# EAGLE design UT61EWIFI (EAGLE 9.6.2)
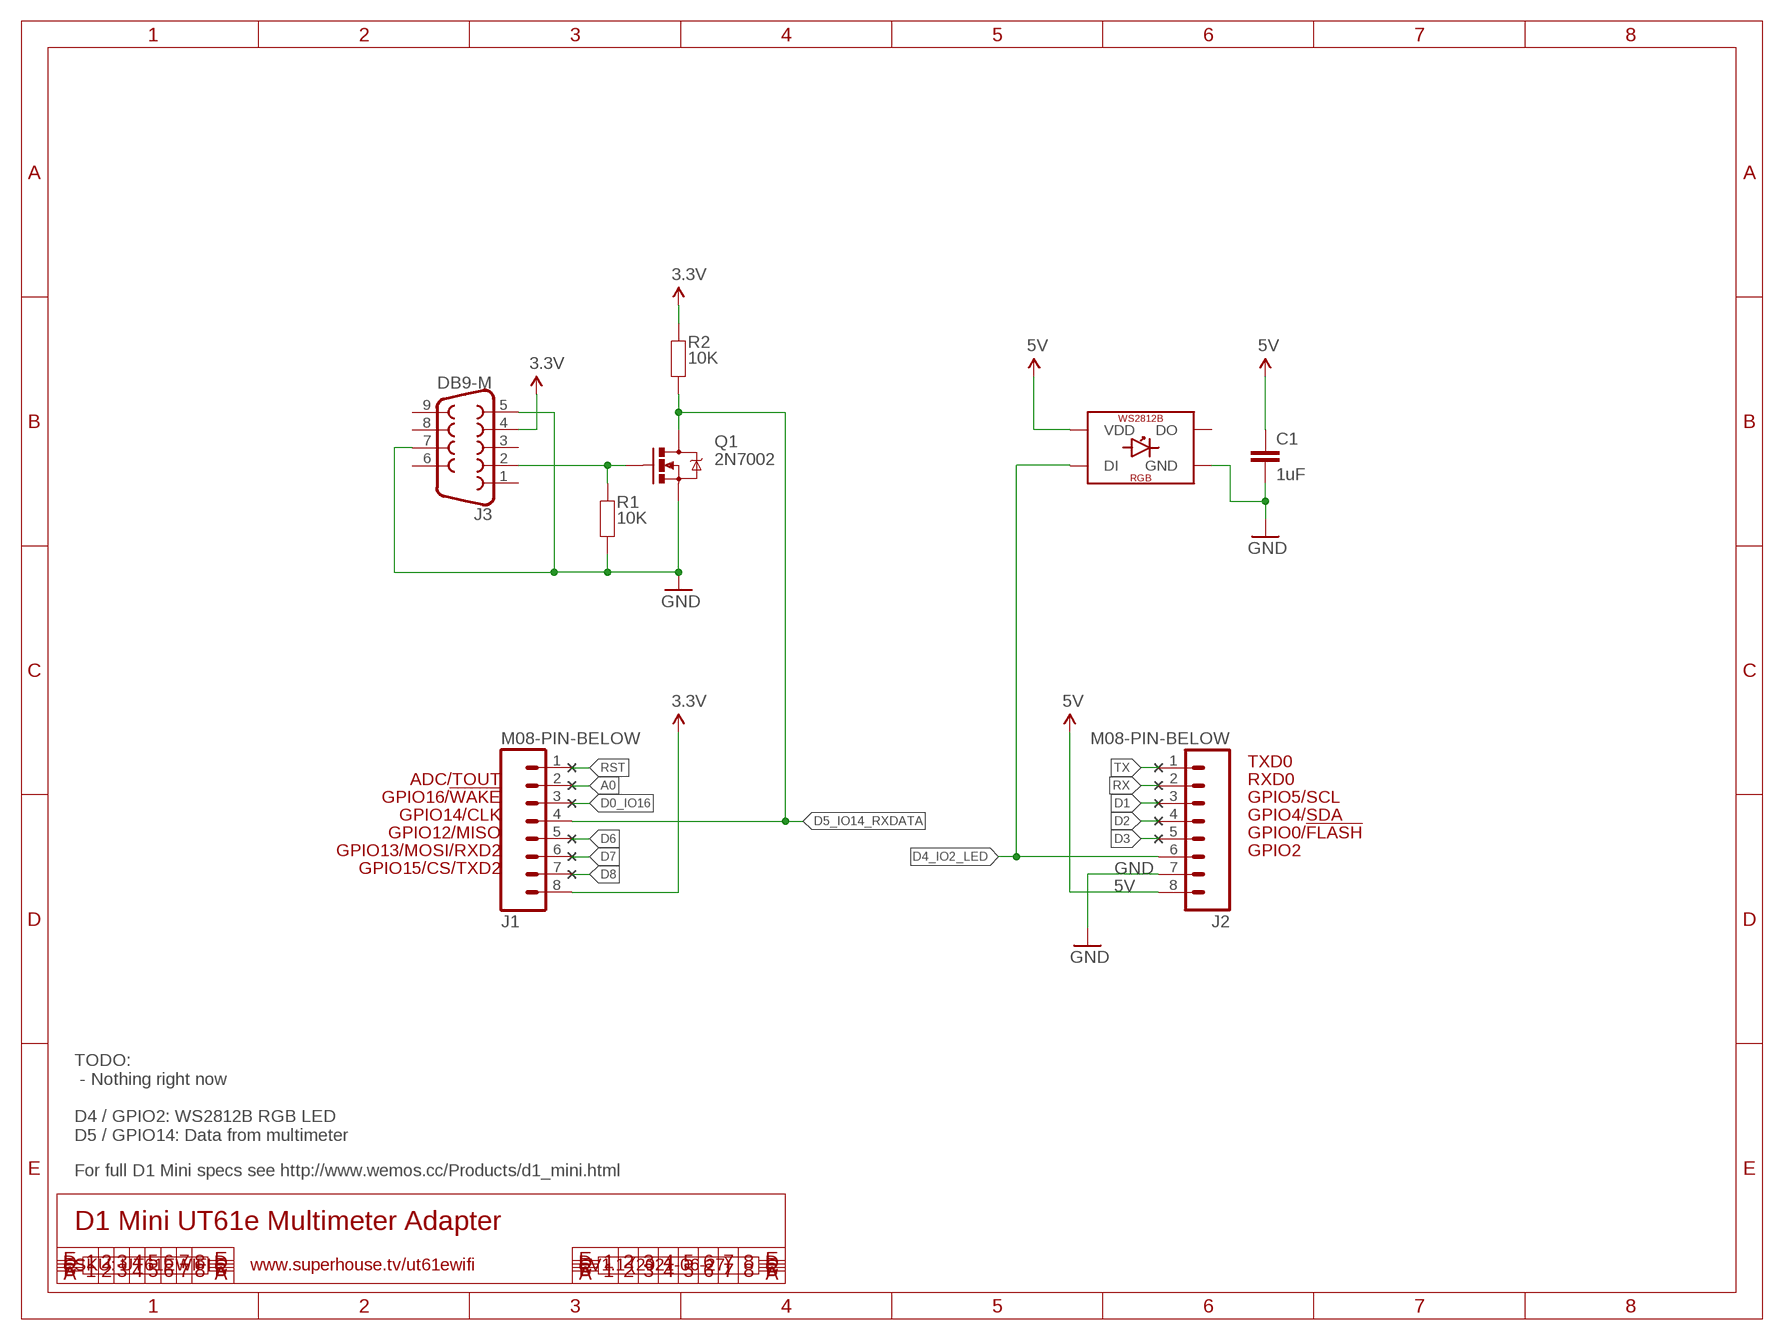
[diagram p0: schematic, sheet 1]

## Parts
C1  1uF  CAP0603  [C0603]
J1  M08-PIN-BELOW  [1X08-P-BELOW]
J2  M08-PIN-BELOW  [1X08-P-BELOW]
J3  DB9-M  DB9-PCB-PLUG  [DB9-PCB-PLUG]
LED1  WS2812B  WS2812B5050  [WS2812B]
Q1  2N7002  MOSFET-NCHANNEL-233  [SOT23-3]
R1  10K  RESISTOR0603  [R0603]
R2  10K  RESISTOR0603  [R0603]

## Nets
3.3V: J1.8 J3.4 R2.2
5V: C1.1 J2.8 LED1.1-VDD(VDD)
A0: J1.2
D0_IO16: J1.3
D1: J2.3
D2: J2.4
D3: J2.5
D4_IO2_LED: J2.6 LED1.4-DIN(DI)
D5_IO14_RXDATA: J1.4 Q1.3(D) R2.1
D6: J1.5
D7: J1.6
D8: J1.7
GND: C1.2 J2.7 J3.5 J3.7 LED1.3-GND(GND) Q1.2(S) R1.1
N$1: J3.2 Q1.1(G) R1.2
RST: J1.1
RX: J2.2
TX: J2.1
Unconnected: J3.1 J3.3 J3.6 J3.8 J3.9 LED1.2-DOUT(DO)

## Notes on the sheet
- TXD0
- ADC/TOUT | RXD0
- GPIO16/!WAKE | GPIO5/SCL
- GPIO14/CLK | GPIO4/SDA
- GPIO12/MISO | GPIO0/!FLASH
- GPIO13/MOSI/RXD2 | GPIO2
- GPIO15/CS/TXD2
- TODO:
   - Nothing right now
  
  D4 / GPIO2: WS2812B RGB LED
  D5 / GPIO14: Data from multimeter
- For full D1 Mini specs see http://www.wemos.cc/Products/d1_mini.html
- D1 Mini UT61e Multimeter Adapter
- SKU: UT61EWIFI | www.superhouse.tv/ut61ewifi | V1.1 (2021-06-27)

## Library data of the parts
C1 = SuperHouse-Capacitors:CAP: Capacitor Standard ceramic capacitor
J1 J2 = SuperHouse-Connectors:M08: 8-way header Standard 1x8 header, and screw terminal variations
J3 = SuperHouse-Connectors:DB9: DB9 Connector; PROD_ID: CONN-09904
LED1 = SuperHouse-LEDs:WS2812B: WS2812B addressable RGB LED
Q1 = SuperHouse-Transistors:MOSFET-NCHANNEL: N-channel MOSFET
R1 R2 = SuperHouse-Resistors:RESISTOR: Resistors in both surface-mount and through-hole versions.

## Net classes
0 default: width 0.203 mm, drill 0.356 mm, clearance 0.152 mm
1 power: width 0.203 mm, clearance 0.152 mm

## Board
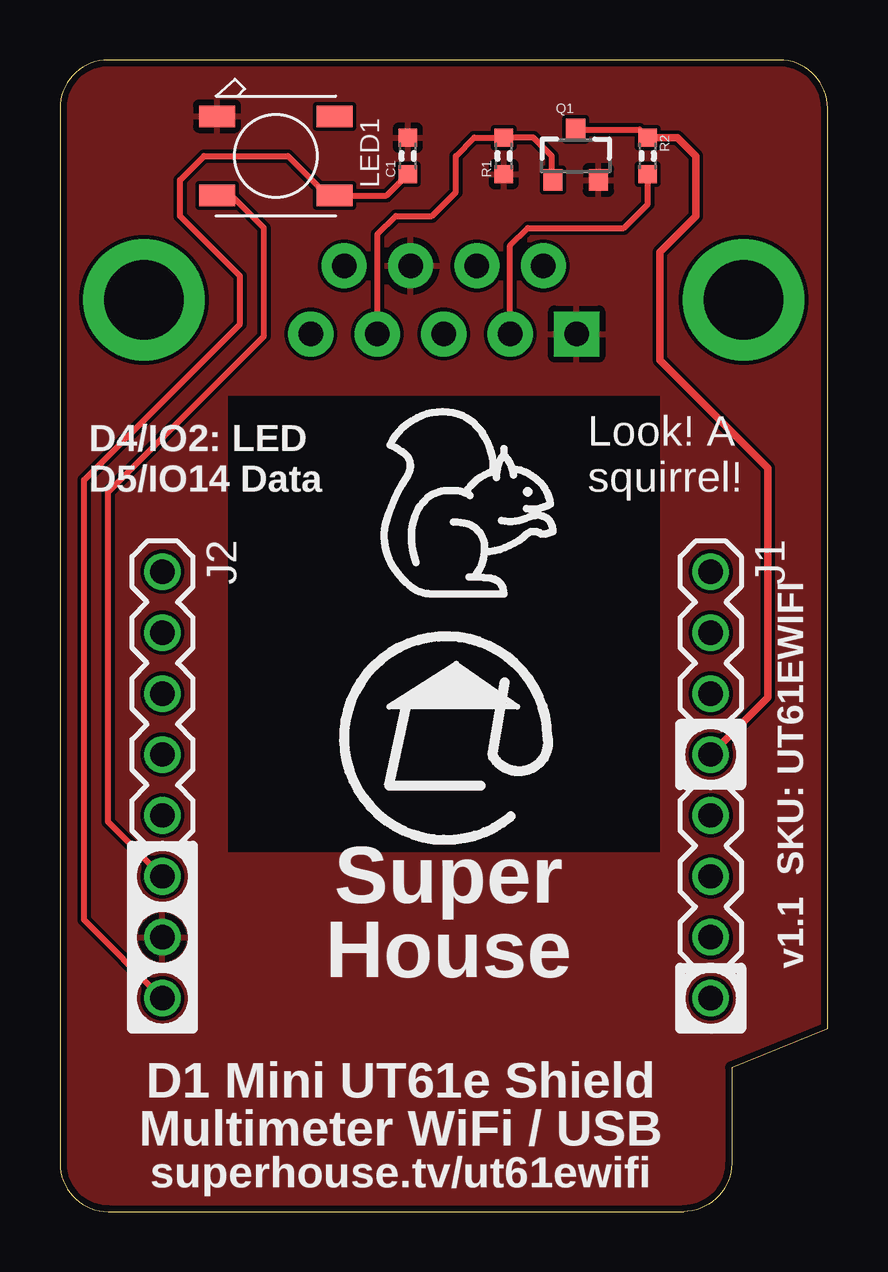
[diagram p1: board, top side]
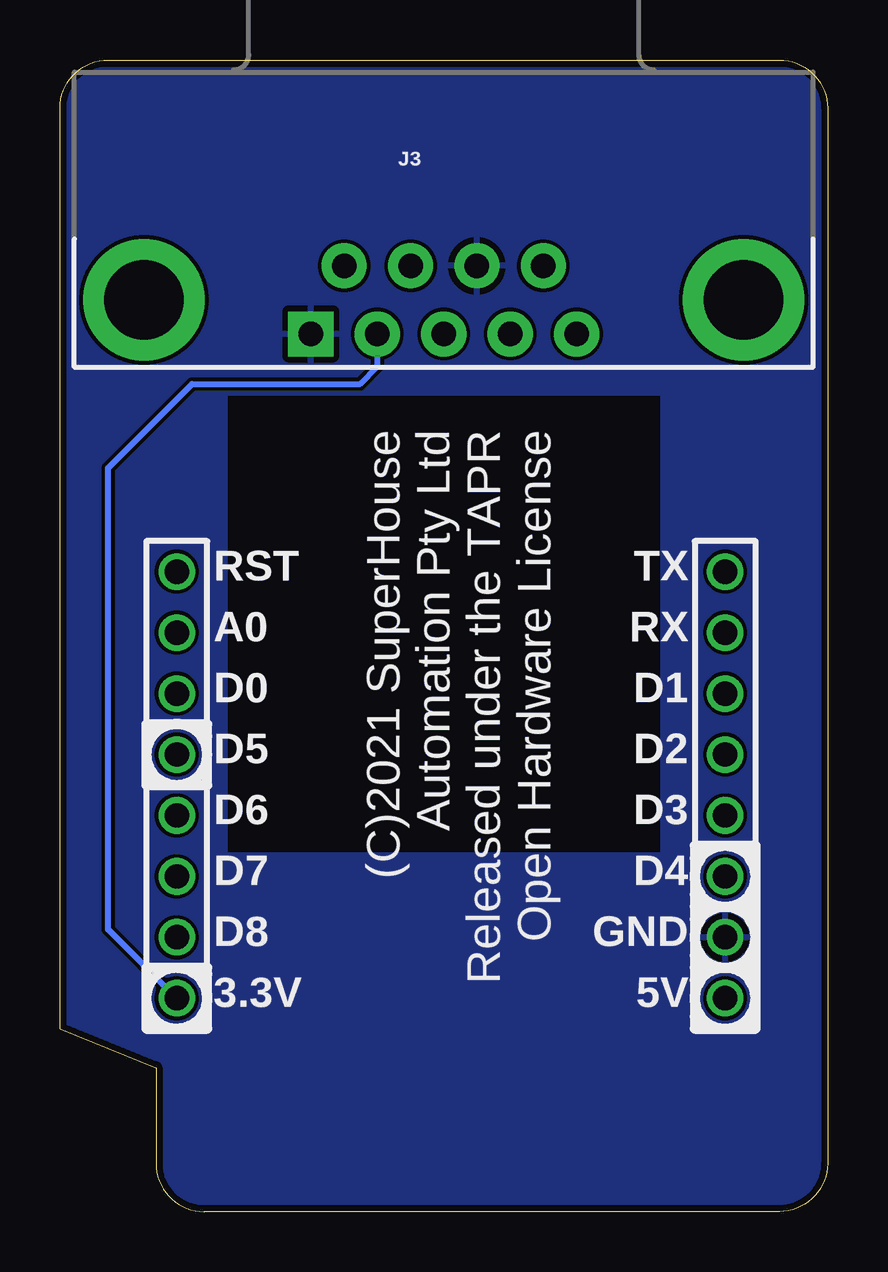
[diagram p2: board, bottom side, seen from below]

Size 32 x 48 mm. Coordinates in mm from the lower left corner, seen from the top.
Outline: 0,46 0,2 arc90 2,0 26,0 arc90 28,2 28,6 32,7.62 32,46 arc90 30,48 2,48 arc90 0,46
Copper layers (1*16): Top 0.035mm / dielectric 1.5mm / Bottom 0.035mm
Design rules "dirt_cheap_dirty_boards.v1": minimum track width 5mil, minimum drill 12mil, track to track 5mil, track to pad 5mil, pad to pad 5mil, via to via 5mil, smd to smd 0mil, copper to edge 10mil, drill to drill 10mil, minimum pad ring 10mil, minimum via ring 6mil, stop-mask expansion 2mil, vias tented up to drill 25mil, thermal gap 10mil
tRestrict: area 7,15 to 25,34
bRestrict: area 7,15 to 25,34

### Footprints (pad centres in the part's own frame; a part is rotated, then mirrored left to right if it is on the bottom)
C0603 = smd 0.762 x 0.762: 1 -0.762,0; 2 0.762,0
1X08-P-BELOW = drill 1.016: 1 -8.89,0; 2 -6.35,0; 3 -3.81,0; 4 -1.27,0; 5 1.27,0; 6 3.81,0; 7 6.35,0; 8 8.89,0
DB9-PCB-PLUG = drill 1.016 pad 1.88: 1 5.54,-1.42; 2 2.77,-1.42; 3 0,-1.42; 4 -2.77,-1.42; 6 4.15,1.42; 7 1.38,1.42; 8 -1.38,1.42; 9 -4.15,1.42 | drill 1.016 pad 1.88 square: 5 -5.54,-1.42 | drill 3.302 pad 5.08: G1 -12.5,0; G2 12.5,0
WS2812B = smd 1.5 x 0.9: 1-VDD 2.45,-1.65; 2-DOUT 2.45,1.65; 3-GND -2.45,1.65; 4-DIN -2.45,-1.65
SOT23-3 = smd 0.8 x 0.9: 1 -0.95,-1; 2 0.95,-1; 3 0,1.1
R0603 = smd 0.762 x 0.762: 1 -0.762,0; 2 0.762,0

### Placement (x,y rotation side)
C1  14.5,44 90 top
J1  27.13,17.78 270 top
J2  4.27,17.78 270 top
J3  16,38 0 bottom
LED1  9,44 0 top
Q1  21.5,44 0 top
R1  18.5,44 90 top
R2  24.5,44 270 top

### Tracks (layer width: path | path; a pad name or v marks a point on that pad's centre or on a via)
3.3V
  Top 0.254: J3.4 18.77,40.27 19.5,41 23.5,41 24.5,42 R2.2
  Bottom 0.254: J1.8 30,11.76 30,31 26.5,34.5 19.5,34.5 18.77,35.23 J3.4
5V
  Top 0.254: C1.1 13.61,42.35 LED1.1-VDD 11.15,42.35 9.5,44 6,44 5,43 5,41.5 7.5,39 7.5,37 1,30.5 1,12.16 J2.8
D4_IO2_LED
  Top 0.254: J2.6 2,16.24 2,30 8.5,36.5 8.5,41 7.15,42.35 LED1.4-DIN
D5_IO14_RXDATA
  Top 0.254: Q1.3 24.16,45.1 R2.1
  Top 0.305: R2.1 25.74,44.76 26.5,44 26.5,41.5 25,40 25,35.5 29.5,31 29.5,21.42 J1.4
GND
  pour Top: 32,46 arc90 30,48 2,48 arc90 0,46 0,2 arc90 2,0 30,0 arc90 32,2
  pour Bottom: 32,2 32,46 arc90 30,48 2,48 arc90 0,46 0,2 arc90 2,0 30,0 arc90
N$1
  Top 0.254: Q1.1 20.5,43.05 20.5,44 19.74,44.76 R1.2 17.26,44.76 16.5,44 16.5,42.5 15.5,41.5 14,41.5 13.23,40.73 J3.2

### Text on the board
tPlace: D4/IO2: LED / D5/IO14 Data | Look! A / squirrel! | v1.1 SKU: UT61EWIFI | Super / House | D1 Mini UT61e Shield | Multimeter WiFi / USB | superhouse.tv/ut61ewifi
bPlace: (C)2021 SuperHouse / Automation Pty Ltd / Released under the TAPR / Open Hardware License | TX | RST | RX | A0 | D1 | D0 | D2 | D5 | D3 | D6 | D4 | D7 | GND | D8 | 5V | 3.3V